# Altium schematic sheet sb-sonata-fpgaio1.SchDoc: IO Banks 14+34 + Flash
size Letter; Organization: NewAE Technology Inc.; Address1: 1083 Queen St., Suite 196; Address2: Halifax; Address3: NS; Address4: Canada B3H 0B2; SheetNumber: 12; SheetTotal: 20; SheetApproved: YES
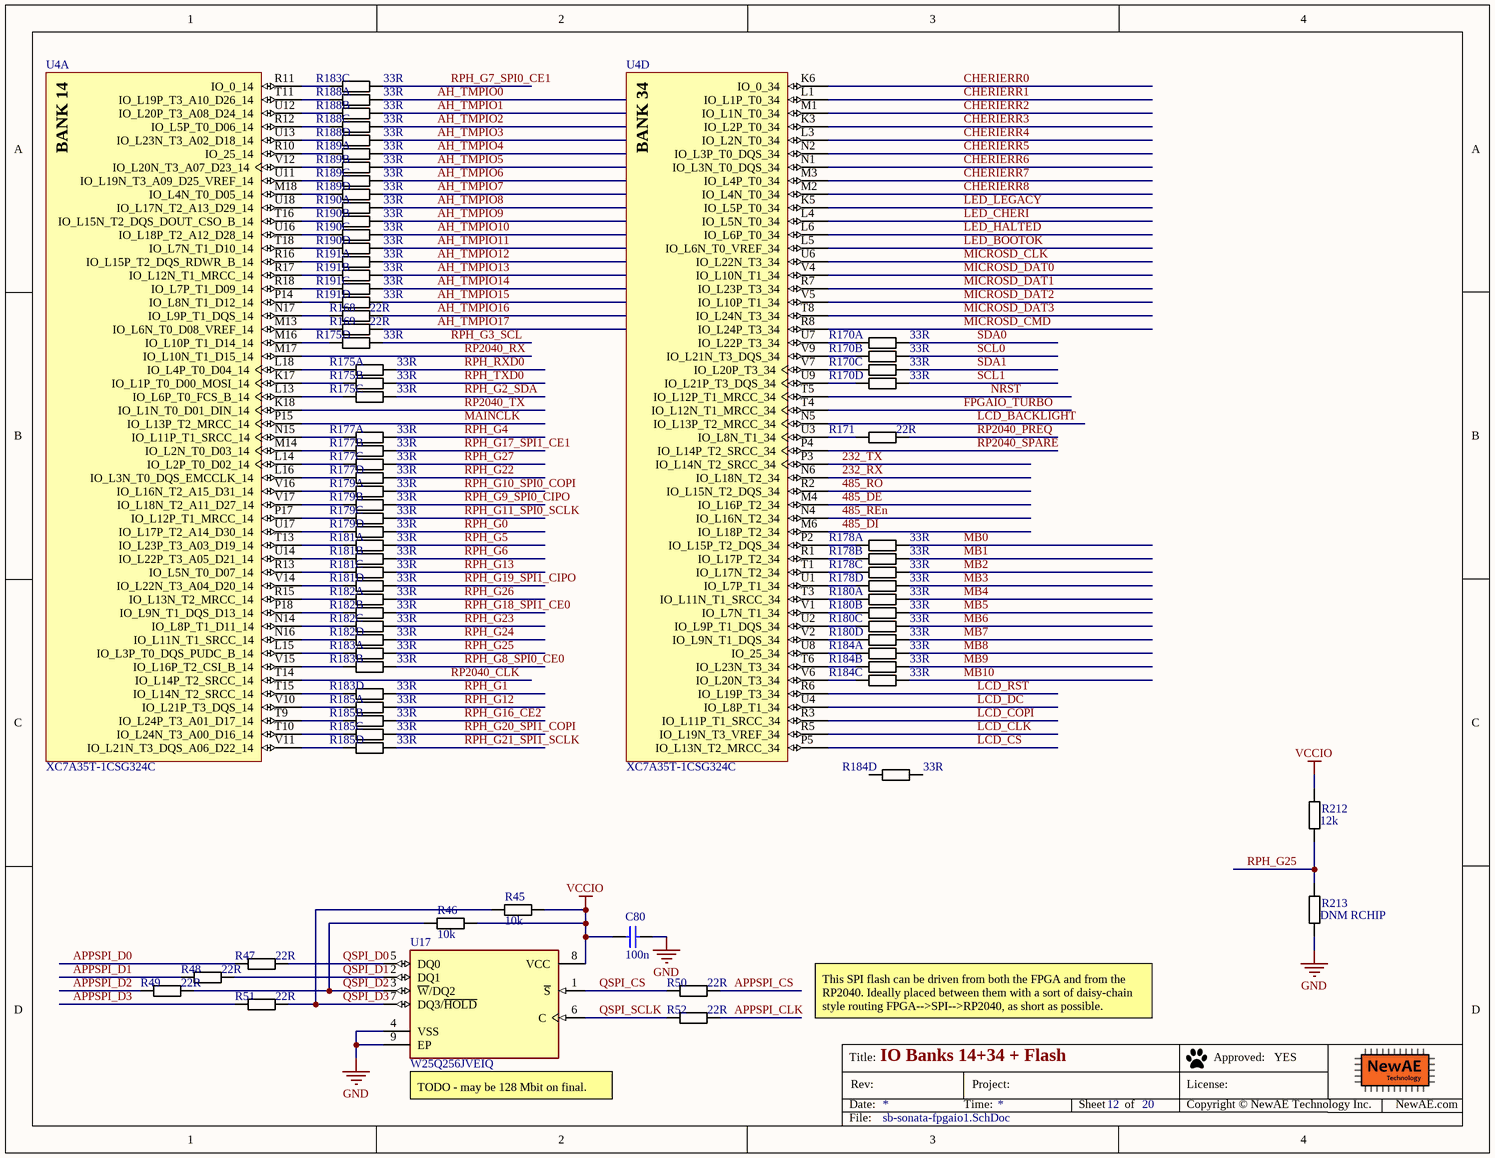
[diagram p0: sb-sonata-fpgaio1.SchDoc]

## Parts
C80  100n  [CAPC0402_M]
R45  10k  [RESC1005X40N]
R46  10k  [RESC1005X40N]
R47  22R  [RESC1005X40N]
R48  22R  [RESC1005X40N]
R49  22R  [RESC1005X40N]
R50  22R  [RESC1005X40N]
R51  22R  [RESC1005X40N]
R52  22R  [RESC1005X40N]
R168  22R  [RESC1005X40N]
R169  22R  [RESC1005X40N]
R170  33R  [741C083]  (parts A,B,C,D of 4)
R171  22R  [RESC1005X40N]
R175  33R  [741C083]  (parts A,B,C,D of 4)
R177  33R  [741C083]  (parts A,B,C,D of 4)
R178  33R  [741C083]  (parts A,B,C,D of 4)
R179  33R  [741C083]  (parts A,B,C,D of 4)
R180  33R  [741C083]  (parts A,B,C,D of 4)
R181  33R  [741C083]  (parts A,B,C,D of 4)
R182  33R  [741C083]  (parts A,B,C,D of 4)
R183  33R  [741C083]  (parts A,B,C,D of 4)
R184  33R  [741C083]  (parts A,B,C,D of 4)
R185  33R  [741C083]  (parts A,B,C,D of 4)
R188  33R  [741C083]  (parts A,B,C,D of 4)
R189  33R  [741C083]  (parts A,B,C,D of 4)
R190  33R  [741C083]  (parts A,B,C,D of 4)
R191  33R  [741C083]  (parts A,B,C,D of 4)
R212  12k  [RESC1608X55N]
R213  DNM RCHIP  [RESC1608X55N]
U4  XC7A35T-1CSG324C  [CSG324]  (parts A,D of 9)
U17  W25Q256JVEIQ  [WSON68_Micron]

## Nets
GND: C80.2 R213.1 U17.4(VSS) U17.9(EP)
VCCIO: C80.1 R45.1 R46.1 R212.2 U17.8(VCC)
232_RX: U4.N6(IO_L18N_T2_34)
232_TX: U4.P3(IO_L14N_T2_SRCC_34)
485_DE: U4.M4(IO_L16P_T2_34)
485_DI: U4.M6(IO_L18P_T2_34)
485_REn: U4.N4(IO_L16N_T2_34)
485_RO: U4.R2(IO_L15N_T2_DQS_34)
AH_TMPIO0: R188.1B
AH_TMPIO1: R188.2B
AH_TMPIO2: R188.3B
AH_TMPIO3: R188.4B
AH_TMPIO4: R189.1B
AH_TMPIO5: R189.2B
AH_TMPIO6: R189.3B
AH_TMPIO7: R189.4B
AH_TMPIO8: R190.1B
AH_TMPIO9: R190.2B
AH_TMPIO10: R190.3B
AH_TMPIO11: R190.4B
AH_TMPIO12: R191.1B
AH_TMPIO13: R191.2B
AH_TMPIO14: R191.3B
AH_TMPIO15: R191.4B
AH_TMPIO16: R168.2
AH_TMPIO17: R169.2
APPSPI_CLK: R52.2
APPSPI_CS: R50.2
APPSPI_D0: R47.1
APPSPI_D1: R48.1
APPSPI_D2: R49.1
APPSPI_D3: R51.1
CHERIERR0: U4.K6(IO_0_34)
CHERIERR1: U4.L1(IO_L1P_T0_34)
CHERIERR2: U4.M1(IO_L1N_T0_34)
CHERIERR3: U4.K3(IO_L2P_T0_34)
CHERIERR4: U4.L3(IO_L2N_T0_34)
CHERIERR5: U4.N2(IO_L3P_T0_DQS_34)
CHERIERR6: U4.N1(IO_L3N_T0_DQS_34)
CHERIERR7: U4.M3(IO_L4P_T0_34)
CHERIERR8: U4.M2(IO_L4N_T0_34)
FPGAIO_TURBO: U4.T4(IO_L12N_T1_MRCC_34)
LCD_BACKLIGHT: U4.N5(IO_L13P_T2_MRCC_34)
LCD_CLK: U4.R5(IO_L19N_T3_VREF_34)
LCD_COPI: U4.R3(IO_L11P_T1_SRCC_34)
LCD_CS: U4.P5(IO_L13N_T2_MRCC_34)
LCD_DC: U4.U4(IO_L8P_T1_34)
LCD_RST: U4.R6(IO_L19P_T3_34)
LED_BOOTOK: U4.L5(IO_L6N_T0_VREF_34)
LED_CHERI: U4.L4(IO_L5N_T0_34)
LED_HALTED: U4.L6(IO_L6P_T0_34)
LED_LEGACY: U4.K5(IO_L5P_T0_34)
MAINCLK: U4.P15(IO_L13P_T2_MRCC_14)
MB0: R178.1B
MB1: R178.2B
MB2: R178.3B
MB3: R178.4B
MB4: R180.1B
MB5: R180.2B
MB6: R180.3B
MB7: R180.4B
MB8: R184.1B
MB9: R184.2B
MB10: R184.3B
MICROSD_CLK: U4.U6(IO_L22N_T3_34)
MICROSD_CMD: U4.R8(IO_L24P_T3_34)
MICROSD_DAT0: U4.V4(IO_L10N_T1_34)
MICROSD_DAT1: U4.R7(IO_L23P_T3_34)
MICROSD_DAT2: U4.V5(IO_L10P_T1_34)
MICROSD_DAT3: U4.T8(IO_L24N_T3_34)
NRST: U4.T5(IO_L12P_T1_MRCC_34)
QSPI_CS: R50.1 U17.1(~{S})
QSPI_D0: R47.2 U17.5(DQ0)
QSPI_D1: R48.2 U17.2(DQ1)
QSPI_D2: R46.2 R49.2 U17.3(~{W}/DQ2)
QSPI_D3: R45.2 R51.2 U17.7(DQ3/~{HOLD})
QSPI_SCLK: R52.1 U17.6(C)
RP2040_CLK: U4.T14(IO_L14P_T2_SRCC_14)
RP2040_PREQ: R171.2
RP2040_RX: U4.M17(IO_L10N_T1_D15_14)
RP2040_SPARE: U4.P4(IO_L14P_T2_SRCC_34)
RP2040_TX: U4.K18(IO_L1N_T0_D01_DIN_14)
RPH_G0: R179.4B
RPH_G1: R183.4B
RPH_G2_SDA: R175.3B
RPH_G3_SCL: R175.4B
RPH_G4: R177.1B
RPH_G5: R181.1B
RPH_G6: R181.2B
RPH_G7_SPI0_CE1: R183.3B
RPH_G8_SPI0_CE0: R183.2B
RPH_G9_SPI0_CIPO: R179.2B
RPH_G10_SPI0_COPI: R179.1B
RPH_G11_SPI0_SCLK: R179.3B
RPH_G12: R185.1B
RPH_G13: R181.3B
RPH_G16_CE2: R185.2B
RPH_G17_SPI1_CE1: R177.2B
RPH_G18_SPI1_CE0: R182.2B
RPH_G19_SPI1_CIPO: R181.4B
RPH_G20_SPI1_COPI: R185.3B
RPH_G21_SPI1_SCLK: R185.4B
RPH_G22: R177.4B
RPH_G23: R182.3B
RPH_G24: R182.4B
RPH_G25: R183.1B R212.1 R213.2
RPH_G26: R182.1B
RPH_G27: R177.3B
RPH_RXD0: R175.1B
RPH_TXD0: R175.2B
SCL0: R170.2B
SCL1: R170.4B
SDA0: R170.1B
SDA1: R170.3B
NetR168_1: R168.1 U4.N17(IO_L9P_T1_DQS_14)
NetR169_1: R169.1 U4.M13(IO_L6N_T0_D08_VREF_14)
NetR170_1A: R170.1A U4.U7(IO_L22P_T3_34)
NetR170_2A: R170.2A U4.V9(IO_L21N_T3_DQS_34)
NetR170_3A: R170.3A U4.V7(IO_L20P_T3_34)
NetR170_4A: R170.4A U4.U9(IO_L21P_T3_DQS_34)
NetR171_1: R171.1 U4.U3(IO_L8N_T1_34)
NetR175_1A: R175.1A U4.L18(IO_L4P_T0_D04_14)
NetR175_2A: R175.2A U4.K17(IO_L1P_T0_D00_MOSI_14)
NetR175_3A: R175.3A U4.L13(IO_L6P_T0_FCS_B_14)
NetR175_4A: R175.4A U4.M16(IO_L10P_T1_D14_14)
NetR177_1A: R177.1A U4.N15(IO_L11P_T1_SRCC_14)
NetR177_2A: R177.2A U4.M14(IO_L2N_T0_D03_14)
NetR177_3A: R177.3A U4.L14(IO_L2P_T0_D02_14)
NetR177_4A: R177.4A U4.L16(IO_L3N_T0_DQS_EMCCLK_14)
NetR178_1A: R178.1A U4.P2(IO_L15P_T2_DQS_34)
NetR178_2A: R178.2A U4.R1(IO_L17P_T2_34)
NetR178_3A: R178.3A U4.T1(IO_L17N_T2_34)
NetR178_4A: R178.4A U4.U1(IO_L7P_T1_34)
NetR179_1A: R179.1A U4.V16(IO_L16N_T2_A15_D31_14)
NetR179_2A: R179.2A U4.V17(IO_L18N_T2_A11_D27_14)
NetR179_3A: R179.3A U4.P17(IO_L12P_T1_MRCC_14)
NetR179_4A: R179.4A U4.U17(IO_L17P_T2_A14_D30_14)
NetR180_1A: R180.1A U4.T3(IO_L11N_T1_SRCC_34)
NetR180_2A: R180.2A U4.V1(IO_L7N_T1_34)
NetR180_3A: R180.3A U4.U2(IO_L9P_T1_DQS_34)
NetR180_4A: R180.4A U4.V2(IO_L9N_T1_DQS_34)
NetR181_1A: R181.1A U4.T13(IO_L23P_T3_A03_D19_14)
NetR181_2A: R181.2A U4.U14(IO_L22P_T3_A05_D21_14)
NetR181_3A: R181.3A U4.R13(IO_L5N_T0_D07_14)
NetR181_4A: R181.4A U4.V14(IO_L22N_T3_A04_D20_14)
NetR182_1A: R182.1A U4.R15(IO_L13N_T2_MRCC_14)
NetR182_2A: R182.2A U4.P18(IO_L9N_T1_DQS_D13_14)
NetR182_3A: R182.3A U4.N14(IO_L8P_T1_D11_14)
NetR182_4A: R182.4A U4.N16(IO_L11N_T1_SRCC_14)
NetR183_1A: R183.1A U4.L15(IO_L3P_T0_DQS_PUDC_B_14)
NetR183_2A: R183.2A U4.V15(IO_L16P_T2_CSI_B_14)
NetR183_3A: R183.3A U4.R11(IO_0_14)
NetR183_4A: R183.4A U4.T15(IO_L14N_T2_SRCC_14)
NetR184_1A: R184.1A U4.U8(IO_25_34)
NetR184_2A: R184.2A U4.T6(IO_L23N_T3_34)
NetR184_3A: R184.3A U4.V6(IO_L20N_T3_34)
NetR185_1A: R185.1A U4.V10(IO_L21P_T3_DQS_14)
NetR185_2A: R185.2A U4.T9(IO_L24P_T3_A01_D17_14)
NetR185_3A: R185.3A U4.T10(IO_L24N_T3_A00_D16_14)
NetR185_4A: R185.4A U4.V11(IO_L21N_T3_DQS_A06_D22_14)
NetR188_1A: R188.1A U4.T11(IO_L19P_T3_A10_D26_14)
NetR188_2A: R188.2A U4.U12(IO_L20P_T3_A08_D24_14)
NetR188_3A: R188.3A U4.R12(IO_L5P_T0_D06_14)
NetR188_4A: R188.4A U4.U13(IO_L23N_T3_A02_D18_14)
NetR189_1A: R189.1A U4.R10(IO_25_14)
NetR189_2A: R189.2A U4.V12(IO_L20N_T3_A07_D23_14)
NetR189_3A: R189.3A U4.U11(IO_L19N_T3_A09_D25_VREF_14)
NetR189_4A: R189.4A U4.M18(IO_L4N_T0_D05_14)
NetR190_1A: R190.1A U4.U18(IO_L17N_T2_A13_D29_14)
NetR190_2A: R190.2A U4.T16(IO_L15N_T2_DQS_DOUT_CSO_B_14)
NetR190_3A: R190.3A U4.U16(IO_L18P_T2_A12_D28_14)
NetR190_4A: R190.4A U4.T18(IO_L7N_T1_D10_14)
NetR191_1A: R191.1A U4.R16(IO_L15P_T2_DQS_RDWR_B_14)
NetR191_2A: R191.2A U4.R17(IO_L12N_T1_MRCC_14)
NetR191_3A: R191.3A U4.R18(IO_L7P_T1_D09_14)
NetR191_4A: R191.4A U4.P14(IO_L8N_T1_D12_14)

Not connected (* = marked no-connect by the designer): R184 4A 4B

## Notes on the sheet
- This SPI flash can be driven from both the FPGA and from the RP2040. Ideally placed between them with a sort of daisy-chain style routing FPGA-->SPI-->RP2040, as short as possible.
- (near U17) TODO - may be 128 Mbit on final.
- Title:
- Date:
- Rev:
- Time:
- Project:
- Sheet
- of
- License:
- Copyright © NewAE Technology Inc.
- Approved:
- NewAE.com
- File:
- (in symbol CMP-0383-00012-1, part A) BANK 14
- (in symbol CMP-0383-00012-1, part D) BANK 34

## Library data of the parts
C80 = CCHIP-100n-0402: 100n, 0402; Manufacture Part Number 1: CGA2B3X7R1V104K050BB; Component Group: Capacitor; Case-EIA: 0402; Part Number: CCHIP-100n-0402; Footprint: 0402; Pin Count: 2; Supplier 1: Digi-Key; Supplier Part Number 1: 445-6901-1-ND; Value: 100n; Mounting Technology: SMT; Component Kind: Standard; Component Type: Standard
R45 R46 = RCHIP-10K-0402: 10k res, 0402, 1%, 1/16W; Manufacture 1: Yageo; Manufacture Part Number 1: RC0402FR-0710KL; Component Group: Resistor; Case-EIA: 0402; Case-Metric: 1005; Rated Power: 0.063W; Rated Voltage: 75VDC; Part Number: RCHIP-10K-0402; Footprint: 0402; Pin Count: 2; Supplier 1: Digi-Key; Supplier Part Number 1: 311-10.0KLRCT-ND; Value: 10k; Tolerance: 1%; Mounting Technology: SMT; Temperature Range: -55C to 155C; Component Kind: Standard; Component Type: Standard
R47-R52 R168 R169 R171 = RCHIP-22R-0402: 22R res, 0402, 1%, 1/16W; Manufacture 1: Yageo; Manufacture Part Number 1: RC0402FR-0722RL; Component Group: Resistor; Case-EIA: 0402; Case-Metric: 1005; Rated Power: 0.063W; Rated Voltage: 75VDC; Part Number: RCHIP-22R-0402; Footprint: 0402; Pin Count: 2; Supplier 1: Digi-Key; Supplier Part Number 1: 311-22.0LRCT-ND; Value: 22R; Tolerance: 1%; Mounting Technology: SMT; Temperature Range: -55C to 155C; Component Kind: Standard; Component Type: Standard
R170 R175 R177-R185 R188-R191 = 741C083330JP: 33-ohm, 0.5mm res array; Manufacture 1: CTS; Component Group: Resistor; PP Material Stack: 0; Part Number: 741C083330JP; Manufacture Part Number 1: 741C083330JP; Pin Count: 8; Supplier 1: Digi-Key; Supplier Part Number 1: 741C083330JPCT-ND; Mounting Technology: SMT; Component Kind: Standard; Component Type: Standard; PP Rotation: 0; PP Rotation1: 0
R212 = RCHIP-12K-0603: 12k res, 0603, 1%, 1/10W; Manufacture 1: Yageo; Manufacture Part Number 1: RC0603FR-0712KL; Component Group: Resistor; Case-EIA: 0603; Case-Metric: 1608; Rated Power: 0.1W; Rated Voltage: 75VDC; Part Number: RCHIP-12K-0603; Footprint: 0603; Pin Count: 2; Supplier 1: Digi-Key; Supplier Part Number 1: 311-12.0KHRCT-ND; Value: 12k; Tolerance: 1%; Mounting Technology: SMT; Temperature Range: -55C to 155C; Component Kind: Standard; Component Type: Standard
R213 = RCHIP-DNM-0603: Do Not Mount Resistor; Case-EIA: 0603; Case-Metric: 1608; Part Number: RCHIP-DNM-0603; Component Group: Resistor; Footprint: 0603; Pin Count: 2; Mounting Technology: SMT; Component Kind: Standard; Component Type: Standard
U4 = CMP-0383-00012-1: Artix-7 FPGA, 210 User I/Os, 0 GTP, 324-Ball BGA, Speed Grade 1, Commercial Grade, Pb-Free; Manufacturer: Xilinx; GTP: 0; Available User I/O: 210; Speed Grades: 1; Logic Cells: 33280; Total Block RAM: 1800 Kb; CMTs: 5; Maximum Distributed RAM: 400 Kb; ComponentLink2URL: http://www.xilinx.com/support/documentation/data_sheets/ds180_7Series_Overview.pdf; ComponentLink2Description: Datasheet; DatasheetVersion: Rev. 1.15; PackageDescription: 324-Ball Wire-Bond Chip-Scale BGA, Body 15 x 15 mm, Pitch 0.8 mm; ComponentLink4URL: http://www.xilinx.com/support/documentation/user_guides/ug475_7Series_Pkg_Pinout.pdf; PackageReference: CSG-324; Mounting Technology: Surface Mount; PackageVersion: Rev. 1.11; ComponentLink1Description: Manufacturer URL; ComponentLink3Description: Pinout; ComponentLink1URL: http://www.xilinx.com/; ComponentLink3URL: http://www.xilinx.com/support/documentation/user_guides/ug475_7Series_Pkg_Pinout.pdf; PartNumber: XC7A35T-1CSG324C; ComponentLink4Description: Package Specification; Operating Temperature Range: Commercial
U17 = MT25QL256ABA1EW9-0SIT: IC FLASH 256M SPI 133MHZ 8WPDFN; Manufacture 1: Winbond; Component Group: Digital IC; PP Material Stack: 0; Part Number: W25Q256JVEIQ; Footprint: WSON-8x6; Manufacture Part Number 1: W25Q256JVEIQ; Pin Count: 9; Supplier 1: Digi-Key; Mounting Technology: SMT; RoHS: Yes; Component Kind: Standard; Component Type: Standard; PP Rotation: 0; PP Rotation1: 0